# Altium project DWS-2_Comutator.PrjPcb
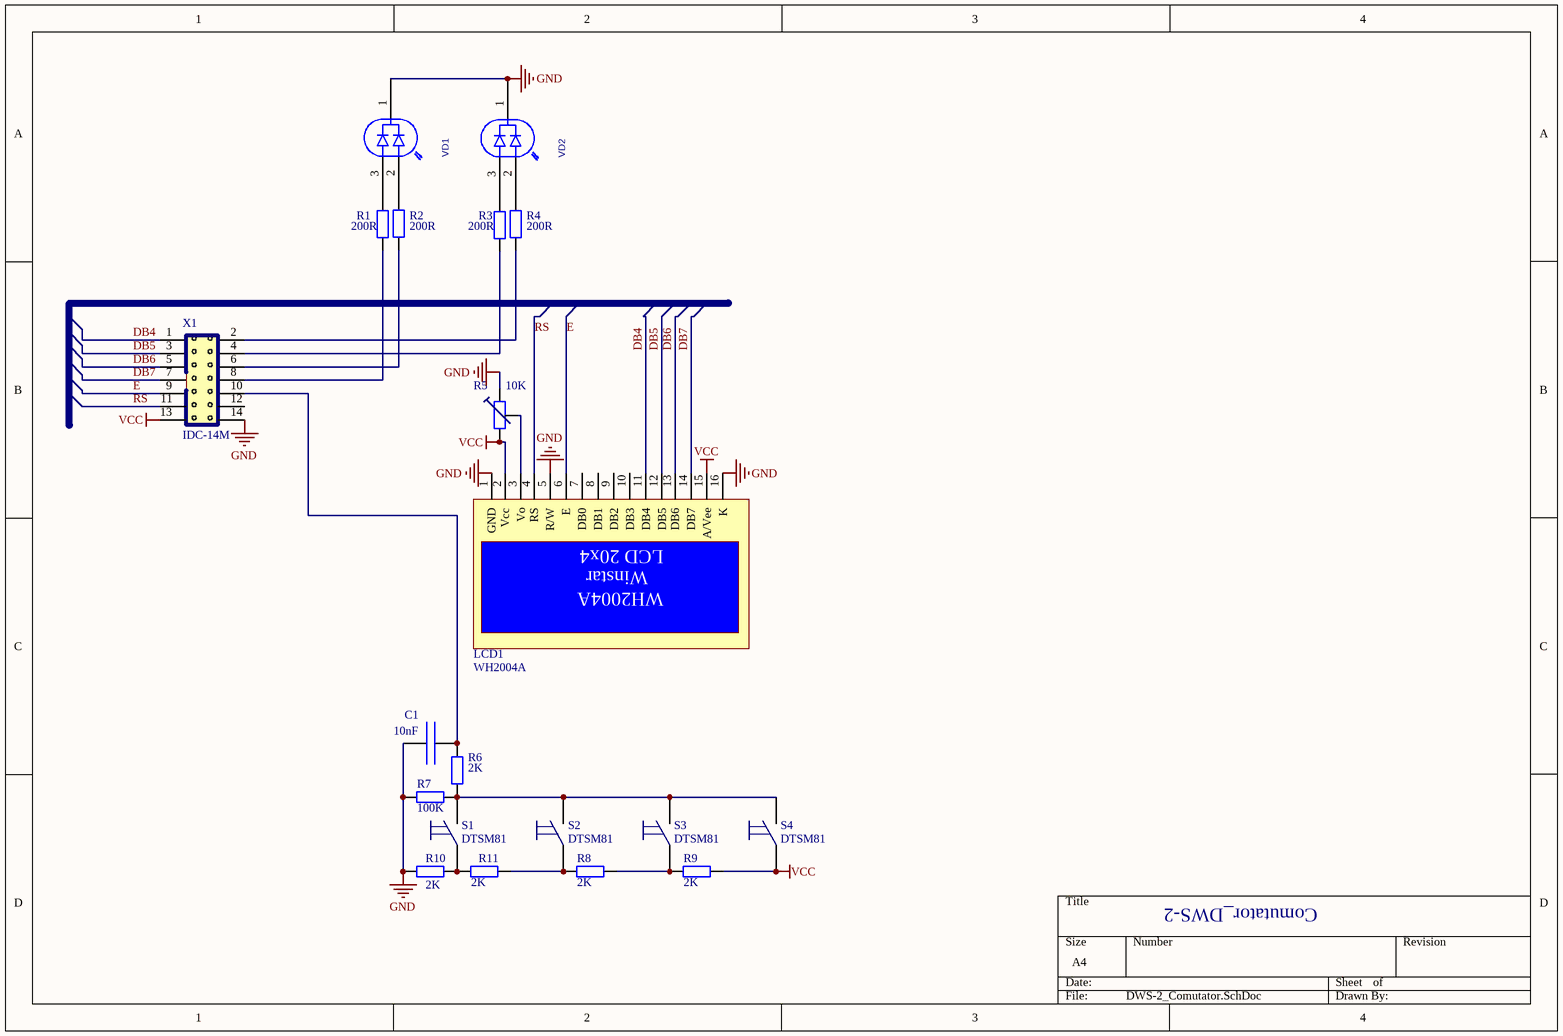
[diagram p0: DWS-2_Comutator.SchDoc]
1 sheet, 20 parts. Net scope: global (net labels, ports and power ports of the same name join across sheets).
Board file: DWS-2_Comutator.PcbDoc

## Sheet DWS-2_Comutator.SchDoc
size A4

### Parts
C1  value 10nF  [C0805]  (hidden comment: KONDENS_SMD)
LCD1  WH2004A  [WH2004A]
R1  value 200R  [C0805]  (hidden comment: RES)
R2  value 200R  [C0805]  (hidden comment: RES)
R3  value 200R  [C0805]  (hidden comment: RES)
R4  value 200R  [C0805]  (hidden comment: RES)
R5  value 10K  [CA6V]  (hidden comment: CA6V)
R6  value 2K  [C0805]  (hidden comment: RES)
R7  value 100K  [C0805]  (hidden comment: RES)
R8  value 2K  [C0805]  (hidden comment: RES)
R9  value 2K  [C0805]  (hidden comment: RES)
R10  value 2K  [C0805]  (hidden comment: RES)
R11  value 2K  [C0805]  (hidden comment: RES)
S1  DTSM81  [DTSM81]
S2  DTSM81  [DTSM81]
S3  DTSM81  [DTSM81]
S4  DTSM81  [DTSM81]
VD1  LIGHTDIODE2  [LIGHTDIODE2]  (value not drawn)
VD2  LIGHTDIODE2  [LIGHTDIODE2]  (value not drawn)
X1  IDC-14M  [IDC-14M]

### Nets
GND: C1.1(A) LCD1.1(GND) LCD1.5(R/W) LCD1.16(K) R5.1 R7.1 R10.1 VD1.1 VD2.1 X1.14
VCC: LCD1.2(Vcc) LCD1.15(A/Vee) R5.2 R9.2 S4.1 X1.13
DB4: LCD1.11(DB4) X1.1
DB5: LCD1.12(DB5) X1.3
DB6: LCD1.13(DB6) X1.5
DB7: LCD1.14(DB7) X1.7
E: LCD1.6(E) X1.9
RS: LCD1.4(RS) X1.11
NetC1_2: C1.2(B) R6.2 X1.10
NetLCD1_3: LCD1.3(Vo) R5.3
NetR1_1: R1.1 X1.8
NetR1_2: R1.2 VD1.3
NetR2_1: R2.1 X1.6
NetR2_2: R2.2 VD1.2
NetR3_1: R3.1 X1.4
NetR3_2: R3.2 VD2.3
NetR4_1: R4.1 X1.2
NetR4_2: R4.2 VD2.2
NetR6_1: R6.1 R7.2 S1.2 S2.2 S3.2 S4.2
NetR8_1: R8.1 R11.2 S2.1
NetR8_2: R8.2 R9.1 S3.1
NetR10_2: R10.2 R11.1 S1.1

Not connected (* = marked no-connect by the designer): LCD1 7(DB0) 8(DB1) 9(DB2) 10(DB3); X1 12

### Notes on the sheet
- Comutator_DWS-2
- (in symbol WH2004A) LCD 20x4; Winstar

### Library data of the parts
R1-R4 R6-R11 = RES: Resistor
R5 = Resistor_podstr
VD1 VD2 = LIGHTDIODE2: Value: *